# Altium schematic sheet GateDriver.SchDoc
size A4; SheetNumber: 2; SheetTotal: 3
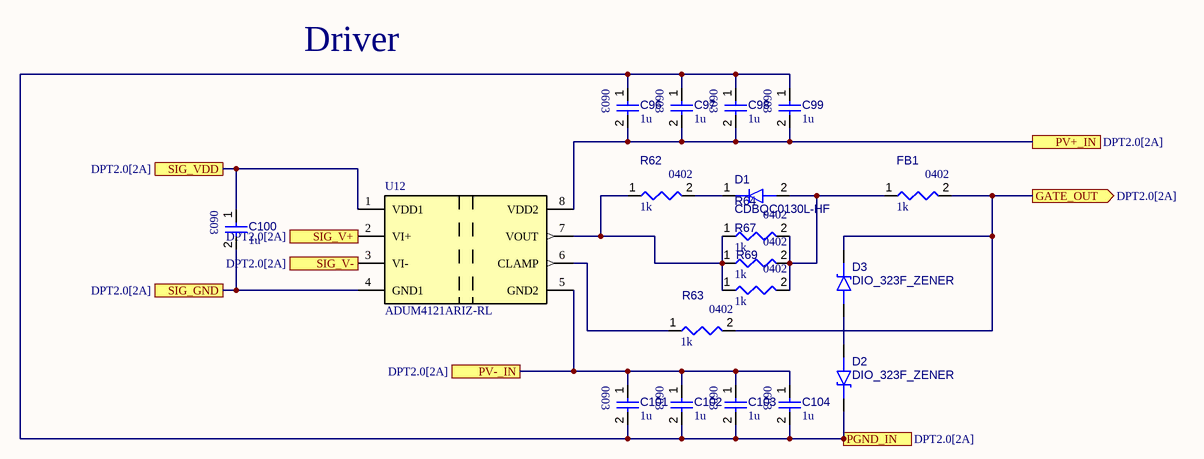
[diagram p0: GateDriver.SchDoc]

## Parts
C96  value 1u  [CAP_0603_HIGH]  (hidden comment: CAP-0603)
C97  value 1u  [CAP_0603_HIGH]  (hidden comment: CAP-0603)
C98  value 1u  [CAP_0603_HIGH]  (hidden comment: CAP-0603)
C99  value 1u  [CAP_0603_HIGH]  (hidden comment: CAP-0603)
C100  value 1u  [CAP_0603_HIGH]  (hidden comment: CAP-0603)
C101  value 1u  [CAP_0603_HIGH]  (hidden comment: CAP-0603)
C102  value 1u  [CAP_0603_HIGH]  (hidden comment: CAP-0603)
C103  value 1u  [CAP_0603_HIGH]  (hidden comment: CAP-0603)
C104  value 1u  [CAP_0603_HIGH]  (hidden comment: CAP-0603)
D1  CDBQC0130L-HF  [DIO_SOD-923F]
D2  DIO_323F_ZENER  [DIO_SOD-323F]
D3  DIO_323F_ZENER  [DIO_SOD-323F]
FB1  value 1k  [RES_0402_HIGH]  (hidden comment: RES-0402)
R62  value 1k  [RES_0402_HIGH]  (hidden comment: RES-0402)
R63  value 1k  [RES_0402_HIGH]  (hidden comment: RES-0402)
R64  value 1k  [RES_0402_HIGH]  (hidden comment: RES-0402)
R67  value 1k  [RES_0402_HIGH]  (hidden comment: RES-0402)
R69  value 1k  [RES_0402_HIGH]  (hidden comment: RES-0402)
U12  ADUM4121ARIZ-RL  [SOIC-8_WIDE]

## Ports
GATE_OUT (out, see DPT2.0[2A]), PGND_IN (see DPT2.0[2A]), PV+_IN (see DPT2.0[2A]), PV-_IN (see DPT2.0[2A]), SIG_GND (see DPT2.0[2A]), SIG_V+ (in, see DPT2.0[2A]), SIG_V- (in, see DPT2.0[2A]), SIG_VDD (see DPT2.0[2A])

## Nets
GATE_OUT: D3.1(K) FB1.2 R63.2 ; port GATE_OUT
PGND_IN: C96.1 C97.1 C98.1 C99.1 C101.2 C102.2 C103.2 C104.2 D2.1(K) ; port PGND_IN
PV+_IN: C96.2 C97.2 C98.2 C99.2 U12.8(VDD2) ; port PV+_IN
PV-_IN: C101.1 C102.1 C103.1 C104.1 U12.5(GND2) ; port PV-_IN
SIG_GND: C100.2 U12.4(GND1) ; port SIG_GND
SIG_V+: U12.2(VI+) ; port SIG_V+
SIG_V-: U12.3(VI-) ; port SIG_V-
SIG_VDD: C100.1 U12.1(VDD1) ; port SIG_VDD
NetD1_1: D1.1(K) R62.2
NetD1_2: D1.2(A) FB1.1 R64.2 R67.2 R69.2
NetD2_2: D2.2(A) D3.2(A)
NetR62_1: R62.1 R64.1 R67.1 R69.1 U12.7(VOUT)
NetR63_1: R63.1 U12.6(CLAMP)

## Notes on the sheet
- Driver

## Library data of the parts
C96-C104 = CMP-001-00084-2: Non polarized SMD capacitor - 0603 (1608 Metric); Package: 0603
D1 = CMP-004-00031-2: Low VF SMD Schottky Barrier Diode; Package: SOD-923F
D2 D3 = CMP-004-00032-1: Generic SOD-323F Zener diode; Value: 6.2V; Package: SOD-323F
FB1 R62-R64 R67 R69 = CMP-009-00177-2: SMD Resistor - 0402 (1005 Metric); Package: 0402
U12 = CMP-019-000000-4: DGTL ISO 5KV 1CH GATE DRVR 8SOIC; Package: 8-SOIC WIDE